# Altium schematic sheet Sheet4.SchDoc: Ejemplo 04: antirrebote de pulsador (RC + Schmitt 74HC14)
size A4; Author: Efrain Alvarado; CompanyName: Universidad de Cuenca - MCIE; DrawnBy: Efrain Alvarado; DocumentNumber: E04; Revision: 1.0; SheetNumber: 1; SheetTotal: 1
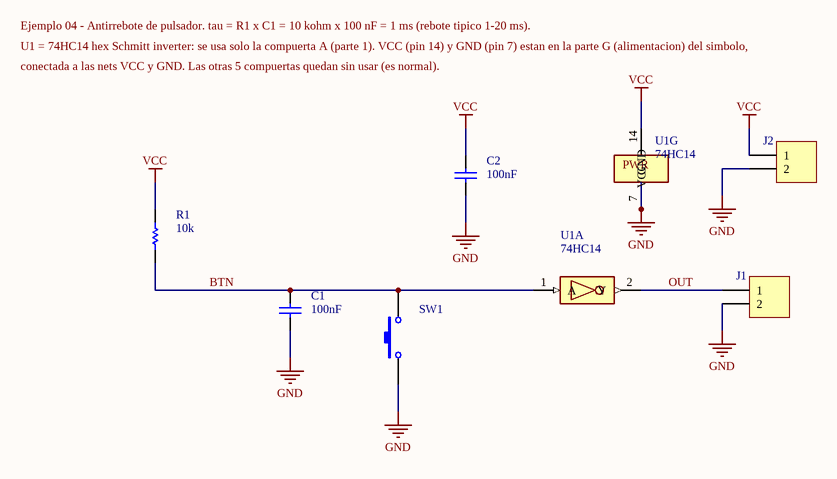
[diagram p0: Sheet4.SchDoc]

## Parts
C1  value 100nF  [RAD-0.3]  (hidden comment: Cap)
C2  value 100nF  [RAD-0.3]  (hidden comment: Cap)
J1  Header 2  [HDR1X2]  (value not drawn)
J2  Header 2  [HDR1X2]  (value not drawn)
R1  value 10k  [AXIAL-0.3]  (hidden comment: Res1)
SW1  SW-PB  [SPST-2]  (value not drawn)
U1  74HC14  [DIP-14]  (parts A,G of 7)

## Nets
GND: C1.1 C2.1 J1.2 J2.2 SW1.1 U1.7(GND)
VCC: C2.2 J2.1 R1.2 U1.14(VCC)
BTN: C1.2 R1.1 SW1.2 U1.1(A)
OUT: J1.1 U1.2(Y)

## Notes on the sheet
- Ejemplo 04 - Antirrebote de pulsador. tau = R1 x C1 = 10 kohm x 100 nF = 1 ms (rebote tipico 1-20 ms).
- U1 = 74HC14 hex Schmitt inverter: se usa solo la compuerta A (parte 1). VCC (pin 14) y GND (pin 7) estan en la parte G (alimentacion) del simbolo,
- conectada a las nets VCC y GND. Las otras 5 compuertas quedan sin usar (es normal).
- (in symbol 74HC14, part G) PWR

## Library data of the parts
C1 = Cap: Ceramic capacitor 100 nF (debounce); Manufacturer: KEMET; Manufacturer Part Number: C320C104K5R5TA; Published: 8-Jun-2000; LatestRevisionDate: 17-Jul-2002; LatestRevisionNote: Re-released for DXP Platform.; PackageReference: RAD-0.3; Publisher: Altium Limited; PackageDescription: Radial Cap, Thru-Hole; 2 Leads; 0.3 in Pin Spacing
C2 = Cap: Ceramic capacitor 100 nF (decoupling of U1); Manufacturer: KEMET; Manufacturer Part Number: C320C104K5R5TA; Published: 8-Jun-2000; LatestRevisionDate: 17-Jul-2002; LatestRevisionNote: Re-released for DXP Platform.; PackageReference: RAD-0.3; Publisher: Altium Limited; PackageDescription: Radial Cap, Thru-Hole; 2 Leads; 0.3 in Pin Spacing
J1 = Header 2: Header 2 pin, 2.54 mm: clean output (OUT, GND); Manufacturer: Generic; Manufacturer Part Number: Pin header 1x2; LatestRevisionDate: 17-Jul-2002; LatestRevisionNote: Re-released for DXP Platform.; Publisher: Altium Limited
J2 = Header 2: Header 2 pin, 2.54 mm: power input (VCC, GND); Manufacturer: Generic; Manufacturer Part Number: Pin header 1x2; LatestRevisionDate: 17-Jul-2002; LatestRevisionNote: Re-released for DXP Platform.; Publisher: Altium Limited
R1 = Res1: Resistor 10 kohm 1/4 W, pull-up; Manufacturer: Yageo; Manufacturer Part Number: CFR-25JB-52-10K; Published: 8-Jun-2000; LatestRevisionDate: 17-Jul-2002; LatestRevisionNote: Re-released for DXP Platform.; PackageReference: AXIAL-0.3; Publisher: Altium Limited; PackageDescription: Axial Device, Thru-Hole; 2 Leads; 0.3 in Pin Spacing
SW1 = SW-PB: Push button, normally open; Manufacturer: Generic; Manufacturer Part Number: Tactile switch 6x6; Published: 24-Mar-1999; LatestRevisionDate: 17-Jul-2002; LatestRevisionNote: Re-released for DXP Platform.; PackageReference: SPST-2; Publisher: Altium Limited; PackageDescription: Switch; 2 Leads
U1 = 74HC14: Hex Schmitt-trigger inverter (gate A used); Manufacturer: Texas Instruments; Manufacturer Part Number: SN74HC14N